# EAGLE design hydrop_board (EAGLE 9.6.2)
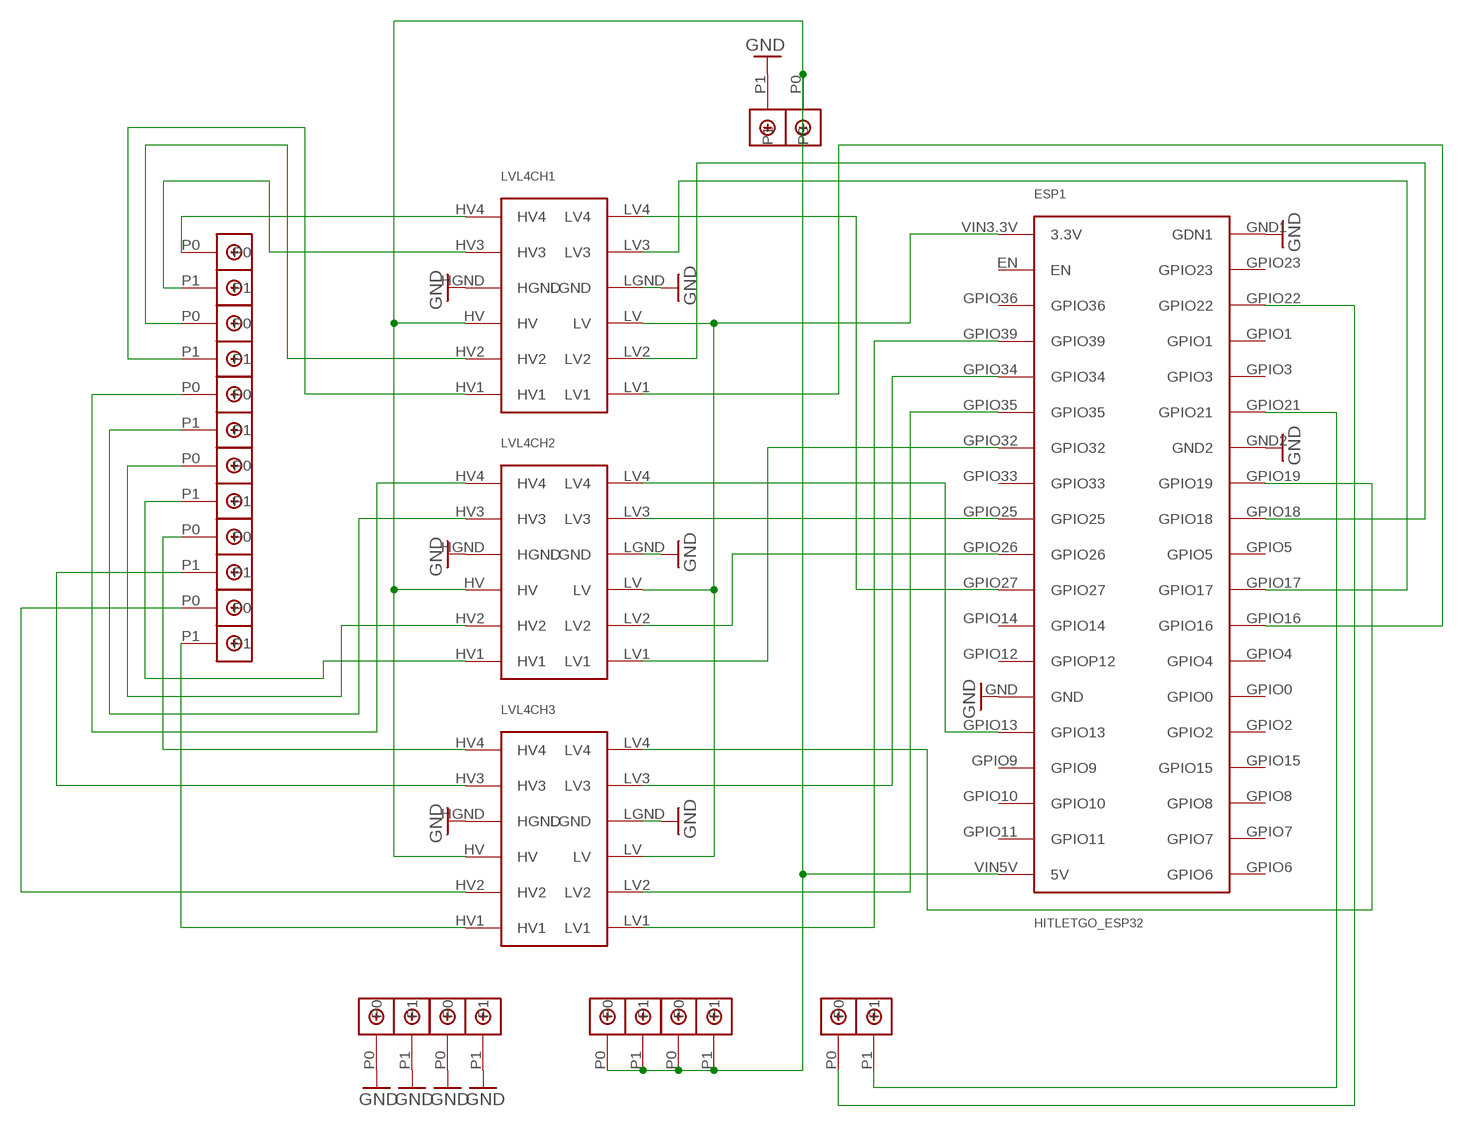
[diagram p0: schematic, sheet 1]

## Parts
ESP1  HITLETGO_ESP32  [HILETGO_ESP32]
LVL4CH1  LEVELSHIFTER_4CH  [LEVELSHIFTER_4CH]
LVL4CH2  LEVELSHIFTER_4CH  [LEVELSHIFTER_4CH]
LVL4CH3  LEVELSHIFTER_4CH  [LEVELSHIFTER_4CH]
U$1  DBCONN-1X2  [DBCONN-1X2]
U$2  DBCONN-1X2  [DBCONN-1X2]
U$3  DBCONN-1X2  [DBCONN-1X2]
U$4  DBCONN-1X2  [DBCONN-1X2]
U$5  DBCONN-1X2  [DBCONN-1X2]
U$6  DBCONN-1X2  [DBCONN-1X2]
U$7  DBCONN-1X2  [DBCONN-1X2]
U$8  DBCONN-1X2  [DBCONN-1X2]
U$9  DBCONN-1X2  [DBCONN-1X2]
U$10  DBCONN-1X2  [DBCONN-1X2]
U$11  DBCONN-1X2  [DBCONN-1X2]
U$12  DBCONN-1X2  [DBCONN-1X2]

## Nets
GND: ESP1.GND ESP1.GND1(GDN1) ESP1.GND2 LVL4CH1.HGND LVL4CH1.LGND LVL4CH2.HGND LVL4CH2.LGND LVL4CH3.HGND LVL4CH3.LGND U$7.P1 U$8.P0 U$8.P1 U$9.P0 U$9.P1
N$1: ESP1.GPIO22 U$12.P0
N$2: ESP1.VIN3.3V(3.3V) LVL4CH1.LV LVL4CH2.LV LVL4CH3.LV
N$3: ESP1.GPIO21 U$12.P1
N$4: ESP1.GPIO27 LVL4CH1.LV4
N$5: LVL4CH1.HV4 U$1.P0
N$6: ESP1.GPIO17 LVL4CH1.LV3
N$7: LVL4CH1.HV3 U$1.P1
N$8: ESP1.GPIO18 LVL4CH1.LV2
N$9: LVL4CH1.HV2 U$2.P0
N$10: ESP1.GPIO16 LVL4CH1.LV1
N$11: ESP1.VIN5V(5V) LVL4CH1.HV LVL4CH2.HV LVL4CH3.HV U$7.P0 U$10.P0 U$10.P1 U$11.P0 U$11.P1
N$12: LVL4CH1.HV1 U$2.P1
N$13: ESP1.GPIO13 LVL4CH2.LV4
N$14: LVL4CH2.HV4 U$3.P0
N$15: ESP1.GPIO25 LVL4CH2.LV3
N$16: LVL4CH2.HV3 U$3.P1
N$17: ESP1.GPIO26 LVL4CH2.LV2
N$18: LVL4CH2.HV2 U$4.P0
N$19: ESP1.GPIO32 LVL4CH2.LV1
N$20: LVL4CH2.HV1 U$4.P1
N$21: ESP1.GPIO19 LVL4CH3.LV4
N$22: LVL4CH3.HV4 U$5.P0
N$23: ESP1.GPIO34 LVL4CH3.LV3
N$24: LVL4CH3.HV3 U$5.P1
N$25: ESP1.GPIO35 LVL4CH3.LV2
N$26: LVL4CH3.HV2 U$6.P0
N$27: ESP1.GPIO39 LVL4CH3.LV1
N$28: LVL4CH3.HV1 U$6.P1
Unconnected: ESP1.EN ESP1.GPIO0 ESP1.GPIO1 ESP1.GPIO2 ESP1.GPIO3 ESP1.GPIO4 ESP1.GPIO5 ESP1.GPIO6 ESP1.GPIO7 ESP1.GPIO8 ESP1.GPIO9 ESP1.GPIO10 ESP1.GPIO11 ESP1.GPIO12(GPIOP12) ESP1.GPIO14 ESP1.GPIO15 ESP1.GPIO23 ESP1.GPIO33 ESP1.GPIO36

## Library data of the parts
ESP1 = esp32:HITLETGO_ESP32
LVL4CH1-LVL4CH3 = levelshift_4ch:LEVELSHIFTER_4CH
U$1-U$12 = Terminal Block Connector:DBCONN-1X2

## Board
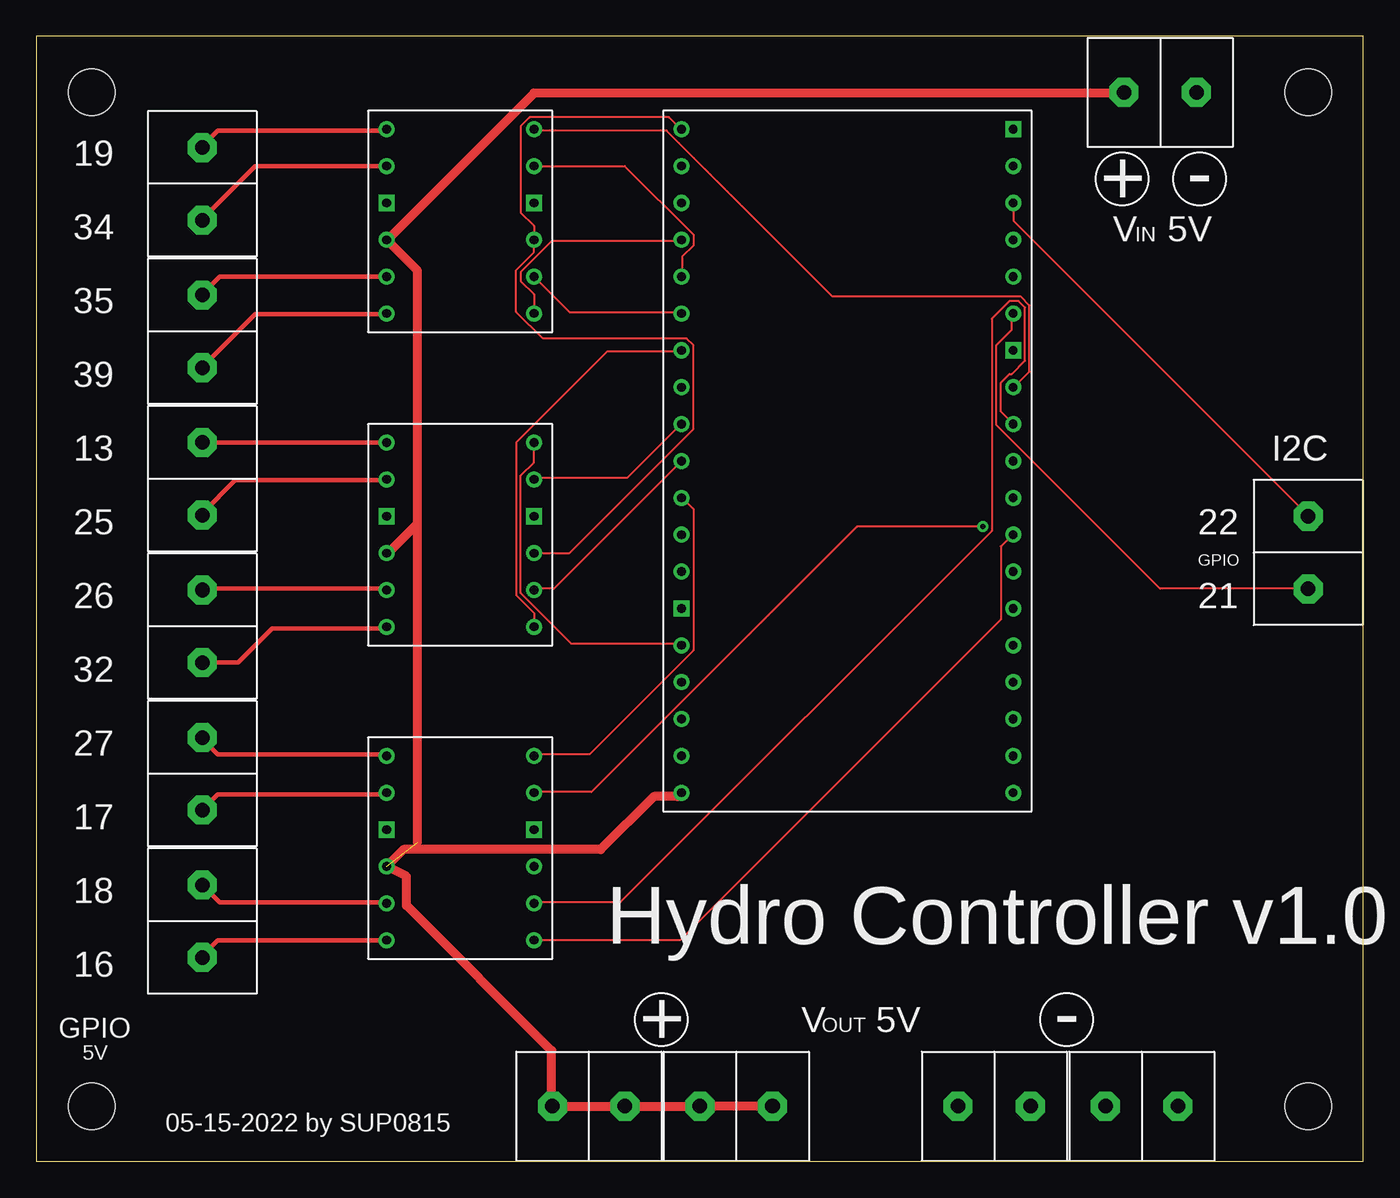
[diagram p1: board, top side]
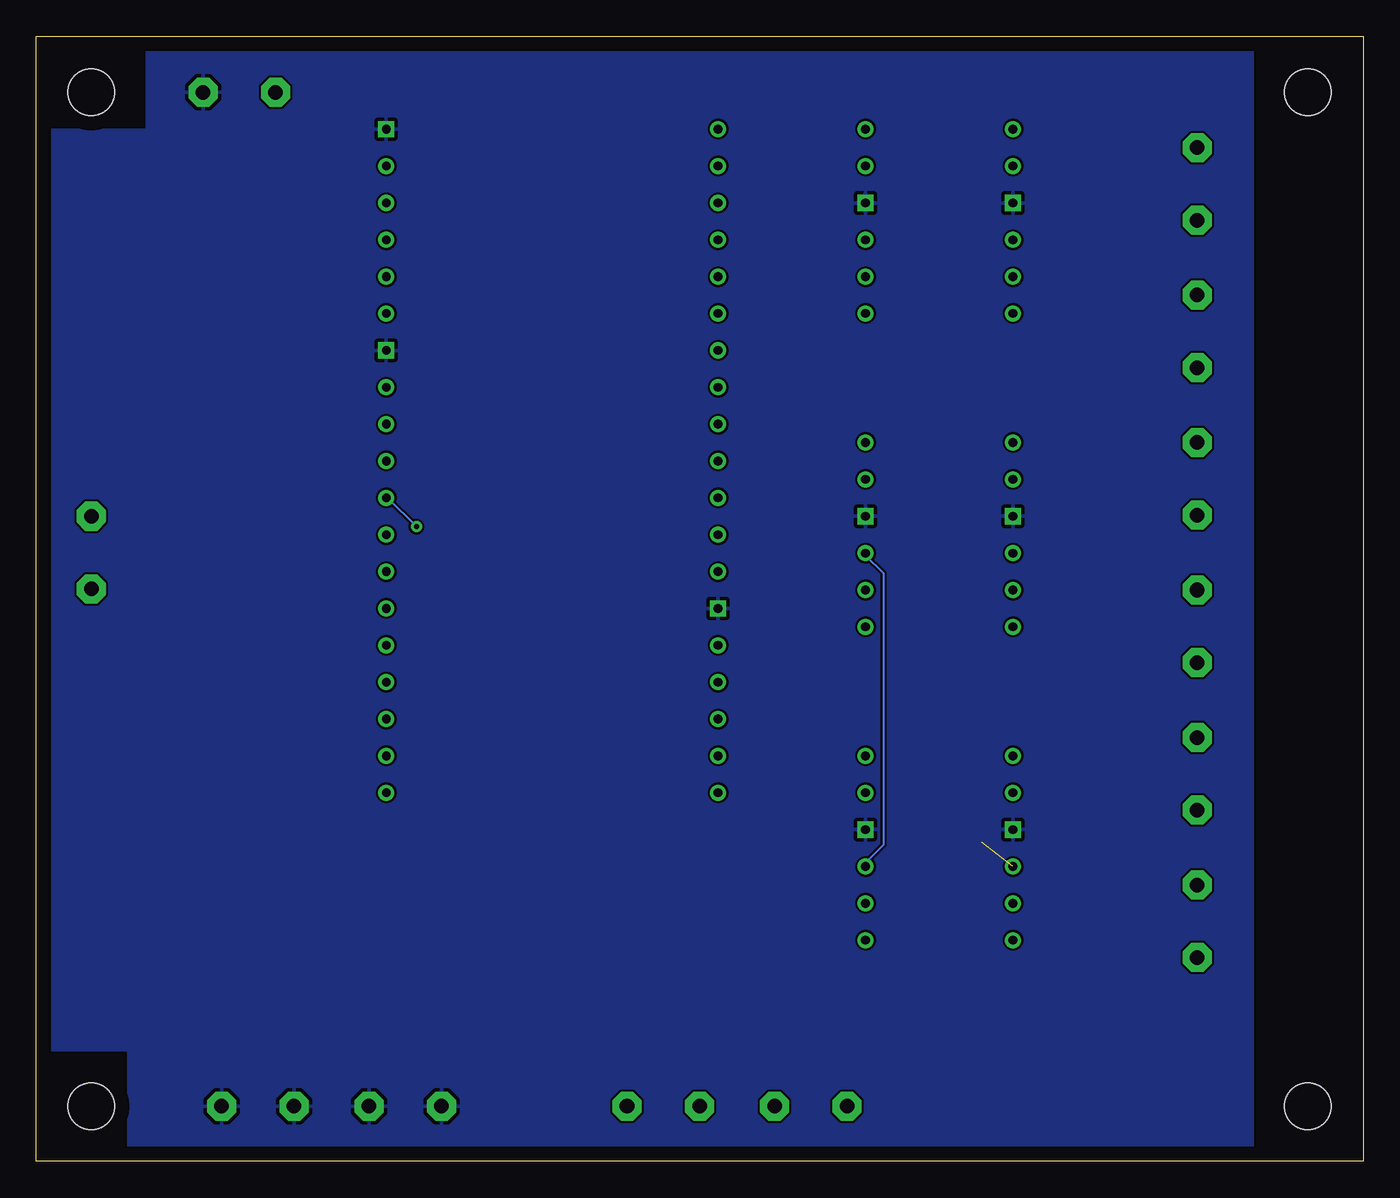
[diagram p2: board, bottom side, seen from below]

Size 91.42 x 77.52 mm. Coordinates in mm from the lower left corner, seen from the top.
Outline: 0,0 91.42,0 91.42,77.52 0,77.52 0,0
Copper layers (1*16): Top 0.035mm / dielectric 1.5mm / Bottom 0.035mm
Design rules "default": minimum track width 6mil, minimum drill 0.35mm, track to track 6mil, track to pad 6mil, pad to pad 6mil, via to via 6mil, smd to smd 6mil, copper to edge 40mil, drill to drill 6mil, minimum pad ring 10mil, minimum via ring 8mil, stop-mask expansion 4mil, vias tented up to drill 0mil, thermal gap 10mil
Holes 3.2 mm at 87.63,73.66 3.81,73.66 3.81,3.81 87.63,3.81

### Footprints (pad centres in the part's own frame; a part is rotated, then mirrored left to right if it is on the bottom)
HILETGO_ESP32 = drill 0.6: EN -6.35,7.62; GPIO0 16.51,-22.86; GPIO1 16.51,2.54; GPIO2 16.51,-25.4; GPIO3 16.51,0; GPIO4 16.51,-20.32; GPIO5 16.51,-12.7; GPIO6 16.51,-35.56; GPIO7 16.51,-33.02; GPIO8 16.51,-30.48; GPIO9 -6.35,-27.94; GPIO10 -6.35,-30.48; GPIO11 -6.35,-33.02; GPIO12 -6.35,-20.32; GPIO13 -6.35,-25.4; GPIO14 -6.35,-17.78; GPIO15 16.51,-27.94; GPIO16 16.51,-17.78; GPIO17 16.51,-15.24; GPIO18 16.51,-10.16; GPIO19 16.51,-7.62; GPIO21 16.51,-2.54; GPIO22 16.51,5.08; GPIO23 16.51,7.62; GPIO25 -6.35,-10.16; GPIO26 -6.35,-12.7; GPIO27 -6.35,-15.24; GPIO32 -6.35,-5.08; GPIO33 -6.35,-7.62; GPIO34 -6.35,0; GPIO35 -6.35,-2.54; GPIO36 -6.35,5.08; GPIO39 -6.35,2.54; VIN3.3V -6.35,10.16; VIN5V -6.35,-35.56 | drill 0.6 square: GND -6.35,-22.86; GND1 16.51,10.16; GND2 16.51,-5.08
LEVELSHIFTER_4CH = drill 0.6 square: HGND -6.35,2.54; LGND 3.81,2.54 | drill 0.6: HV -6.35,0; HV1 -6.35,-5.08; HV2 -6.35,-2.54; HV3 -6.35,5.08; HV4 -6.35,7.62; LV 3.81,0; LV1 3.81,-5.08; LV2 3.81,-2.54; LV3 3.81,5.08; LV4 3.81,7.62
DBCONN-1X2 = drill 1 pad 2 octagon: P0 -2.54,0; P1 2.46,0

### Placement (x,y rotation side)
ESP1  50.8,60.96 0 top
LVL4CH1  30.48,20.32 0 top
LVL4CH2  30.48,41.91 0 top
LVL4CH3  30.48,63.5 0 top
U$1  11.43,26.67 270 top
U$2  11.43,16.51 270 top
U$3  11.43,46.99 270 top
U$4  11.43,36.83 270 top
U$5  11.43,67.31 270 top
U$6  11.43,57.15 270 top
U$7  77.47,73.66 0 top
U$8  76.2,3.81 0 top
U$9  66.04,3.81 0 top
U$10  48.26,3.81 0 top
U$11  38.1,3.81 0 top
U$12  87.63,41.91 270 top

### Tracks (layer width: path | path; a pad name or v marks a point on that pad's centre or on a via)
GND
  pour Bottom: 7.62,77.47 7.62,0 85.09,0 85.09,7.62 91.44,7.62 91.44,71.12 83.82,71.12 83.82,77.47
N$1
  Top 0.152: ESP1.GPIO22 67.36,65.99 67.36,64.77 87.63,44.5 U$12.P0
N$2
  Top 0.152: ESP1.VIN3.3V 44.35,71.17 43.59,71.93 33.98,71.93 33.38,71.32 33.38,65.38 34.29,64.47 LVL4CH3.LV 34.29,62.64 33.07,61.42 33.07,58.52 34.9,56.69 44.81,56.69 45.26,56.24 45.26,50.44 36.73,41.91 LVL4CH2.LV
  Bottom 0.152: LVL4CH1.LV 34.29,20.57 33.07,21.79 33.07,40.54 34.29,41.76 LVL4CH2.LV
N$3
  Top 0.152: ESP1.GPIO21 67.21,58.37 67.21,57.3 66.14,56.24 66.14,50.75 77.42,39.47 87.63,39.47 U$12.P1
N$4
  Top 0.152: LVL4CH1.LV4 34.29,28.04 38.1,28.04 45.26,35.2 45.26,44.96 44.5,45.72 ESP1.GPIO27
N$5
  Top 0.152: 11.43,29.11 U$1.P0
  Top 0.305: LVL4CH1.HV4 24.03,28.04 12.5,28.04 11.43,29.11
N$6  (via drill 0.35)
  Top 0.152: v65.23,43.74 56.54,43.74 38.25,25.45 34.29,25.45 LVL4CH1.LV3
  Bottom 0.152: v65.23,43.74 67.21,45.72 ESP1.GPIO17
N$7
  Top 0.152: 24.08,25.3 LVL4CH1.HV3 | 11.43,24.23 U$1.P1
  Top 0.305: 24.08,25.3 12.5,25.3 11.43,24.23
N$8
  Top 0.152: ESP1.GPIO18 66.45,51.66 66.45,53.65 67.06,54.25 67.21,54.25 68.12,55.17 68.12,58.83 67.67,59.28 67.06,59.28 65.84,58.06 65.84,43.43 40.23,17.83 34.29,17.83 LVL4CH1.LV2
N$9
  Top 0.152: 24.08,17.83 LVL4CH1.HV2
  Top 0.305: 24.08,17.83 12.65,17.83 U$2.P0
N$10
  Top 0.152: LVL4CH1.LV1 44.35,15.24 66.45,37.34 66.45,42.37 67.21,43.13 ESP1.GPIO16
N$11  (1 unrouted)
  Top 0.152: 35.51,3.81 U$11.P0 | 24.23,41.91 LVL4CH2.HV | 24.23,63.55 LVL4CH3.HV
  Top 0.61: U$10.P1 U$10.P0 U$11.P1 U$11.P0 | 35.51,3.81 35.51,7.62 25.5,17.63 25.5,19.63 LVL4CH1.HV 25.3,21.49 38.89,21.49 42.55,25.15 44.2,25.15 ESP1.VIN5V | 26.26,22 26.26,43.94 | LVL4CH3.HV 26.26,61.37 26.26,43.94 | 24.23,41.91 26.26,43.94 | U$7.P0 74.88,73.61 34.29,73.61 24.23,63.55
N$12
  Top 0.152: 11.43,14.17 U$2.P1
  Top 0.305: LVL4CH1.HV1 12.5,15.24 11.43,14.17
N$13
  Top 0.152: LVL4CH2.LV4 34.29,48.16 33.38,47.24 33.38,39.17 36.88,35.66 44.35,35.66 ESP1.GPIO13
N$14
  Top 0.305: U$3.P0 LVL4CH2.HV4
N$15
  Top 0.152: LVL4CH2.LV3 34.29,47.09 40.69,47.09 44.35,50.75 ESP1.GPIO25
N$16
  Top 0.152: 24.08,46.94 LVL4CH2.HV3 | 11.43,44.65 U$3.P1
  Top 0.305: 24.08,46.94 13.72,46.94 11.43,44.65
N$17
  Top 0.152: ESP1.GPIO26 35.66,39.47 34.29,39.47 LVL4CH2.LV2
N$18
  Top 0.152: 24.08,39.47 LVL4CH2.HV2 | 11.43,39.47 U$4.P0
  Top 0.305: 11.43,39.47 24.08,39.47
N$19
  Top 0.152: LVL4CH2.LV1 34.29,37.79 33.07,39.01 33.07,49.53 39.32,55.78 44.35,55.78 ESP1.GPIO32
N$20
  Top 0.152: 24.08,36.73 LVL4CH2.HV1
  Top 0.305: 24.08,36.73 16.26,36.73 13.9,34.37 U$4.P1
N$21
  Top 0.152: LVL4CH3.LV4 34.29,71.02 43.43,71.02 54.86,59.59 67.82,59.59 68.43,58.98 68.43,54.41 67.36,53.34 ESP1.GPIO19
N$22
  Top 0.152: 24.08,71.02 LVL4CH3.HV4 | 11.43,69.95 U$5.P0
  Top 0.305: 24.08,71.02 12.5,71.02 11.43,69.95
N$23
  Top 0.152: LVL4CH3.LV3 40.54,68.58 45.26,63.86 45.26,63.09 44.5,62.33 44.5,60.96 ESP1.GPIO34
N$24
  Top 0.152: 11.43,64.92 U$5.P1
  Top 0.305: LVL4CH3.HV3 15.09,68.58 11.43,64.92
N$25
  Top 0.152: LVL4CH3.LV2 36.73,58.52 44.35,58.52 ESP1.GPIO35
N$26
  Top 0.152: 11.43,59.74 U$6.P0
  Top 0.305: LVL4CH3.HV2 12.65,60.96 11.43,59.74
N$27
  Top 0.152: LVL4CH3.LV1 34.29,59.74 33.38,60.65 33.38,61.26 35.51,63.4 44.35,63.4 ESP1.GPIO39
N$28
  Top 0.152: 24.08,58.37 LVL4CH3.HV1 | 11.43,54.71 U$6.P1
  Top 0.305: 24.08,58.37 15.09,58.37 11.43,54.71

### Text on the board
tNames: 19 | - | + | 34 | V 5V | IN | 35 | 39 | 13 | I2C | 25 | 22 | GPIO | 26 | 21 | 32 | 27 | 17 | 18 | 16 | GPIO | Hydro Controller v1.0 | V 5V | OUT | - | + | 5V | 05-15-2022 by SUP0815